# Altium schematic sheet ATM90E32AS.SchDoc: Three Phase Monitoring
size 419 x 296 mm; DocumentNumber: 3; SheetNumber: 3; SheetTotal: 4
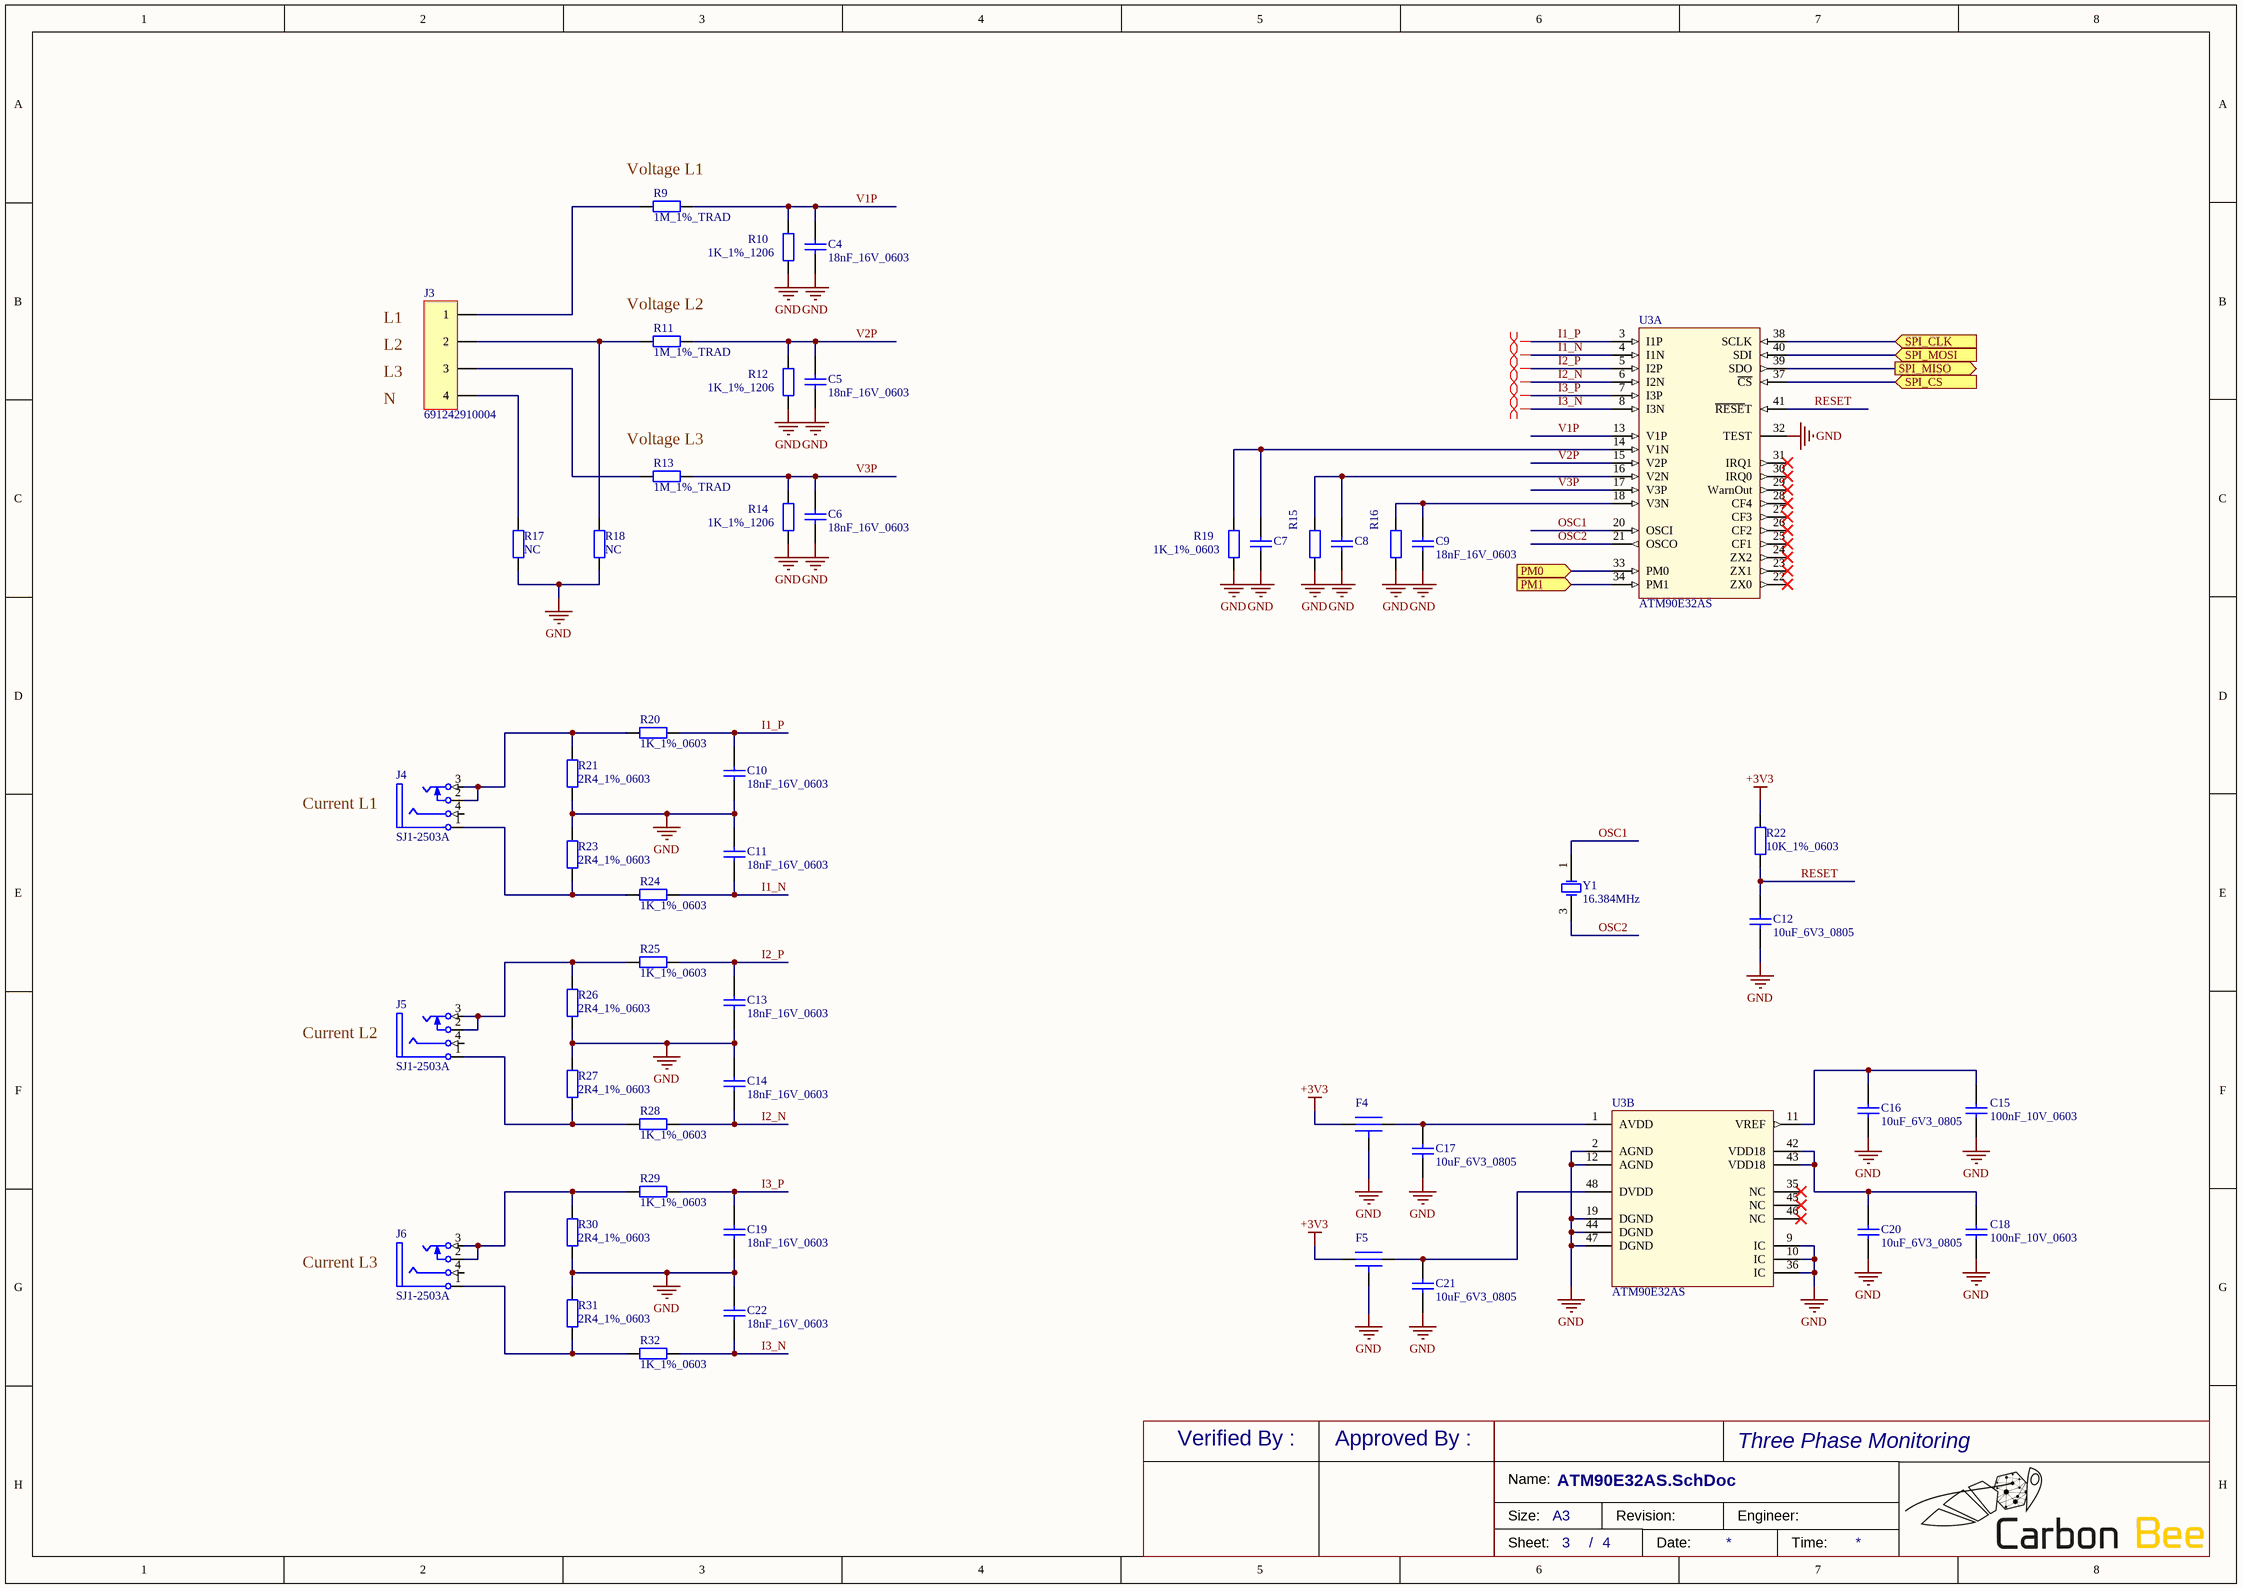
[diagram p0: ATM90E32AS.SchDoc]

## Parts
C4  18nF_16V_0603  [C0603]
C5  18nF_16V_0603  [C0603]
C6  18nF_16V_0603  [C0603]
C7  18nF_16V_0603  [C0603]  (value not drawn)
C8  18nF_16V_0603  [C0603]  (value not drawn)
C9  18nF_16V_0603  [C0603]
C10  18nF_16V_0603  [C0603]
C11  18nF_16V_0603  [C0603]
C12  10uF_6V3_0805  [C0805]
C13  18nF_16V_0603  [C0603]
C14  18nF_16V_0603  [C0603]
C15  100nF_10V_0603  [C0603]
C16  10uF_6V3_0805  [C0805]
C17  10uF_6V3_0805  [C0805]
C18  100nF_10V_0603  [C0603]
C19  18nF_16V_0603  [C0603]
C20  10uF_6V3_0805  [C0805]
C21  10uF_6V3_0805  [C0805]
C22  18nF_16V_0603  [C0603]
F4  EMI  [EMIFIL_0603]  (value not drawn)
F5  EMI  [EMIFIL_0603]  (value not drawn)
J3  691242910004  [691242910004]
J4  SJ1-2503A  [SJ1-2503A]
J5  SJ1-2503A  [SJ1-2503A]
J6  SJ1-2503A  [SJ1-2503A]
R9  1M_1%_TRAD  [AXIAL-0.3]
R10  1K_1%_1206  [R1206]
R11  1M_1%_TRAD  [AXIAL-0.3]
R12  1K_1%_1206  [R1206]
R13  1M_1%_TRAD  [AXIAL-0.3]
R14  1K_1%_1206  [R1206]
R15  1K_1%_0603  [R0603]  (value not drawn)
R16  1K_1%_0603  [R0603]  (value not drawn)
R17  NC  [AXIAL-0.4]
R18  NC  [AXIAL-0.4]
R19  1K_1%_0603  [R0603]
R20  1K_1%_0603  [R0603]
R21  2R4_1%_0603  [R0603]
R22  10K_1%_0603  [R0603]
R23  2R4_1%_0603  [R0603]
R24  1K_1%_0603  [R0603]
R25  1K_1%_0603  [R0603]
R26  2R4_1%_0603  [R0603]
R27  2R4_1%_0603  [R0603]
R28  1K_1%_0603  [R0603]
R29  1K_1%_0603  [R0603]
R30  2R4_1%_0603  [R0603]
R31  2R4_1%_0603  [R0603]
R32  1K_1%_0603  [R0603]
U3  ATM90E32AS  [TQFP48]  (parts A,B of 2)
Y1  16.384MHz  [OSC_3.2X2.5]

## Ports
PM0 (in), PM1 (in), SPI_CLK (in), SPI_CS (in), SPI_MISO (out), SPI_MOSI (in)

## Nets
+3V3: F4.2 F5.2 R22.2
GND: C4.1 C5.1 C6.1 C7.1 C8.1 C9.1 C10.1 C11.1 C12.1 C13.1 C14.1 C15.1 C16.1 C17.1 C18.1 C19.1 C20.1 C21.1 C22.1 F4.GND F5.GND R10.1 R12.1 R14.1 R15.1 R16.1 R17.2 R18.2 R19.1 R21.2 R23.2 R26.2 R27.2 R30.2 R31.2 U3.2(AGND) U3.9(IC) U3.10(IC) U3.12(AGND) U3.19(DGND) U3.32(TEST) U3.36(IC) U3.44(DGND) U3.47(DGND)
I1_N: C11.2 R24.1 U3.4(I1N)
I1_P: C10.2 R20.1 U3.3(I1P)
I2_N: C14.2 R28.1 U3.6(I2N)
I2_P: C13.2 R25.1 U3.5(I2P)
I3_N: C22.2 R32.1 U3.8(I3N)
I3_P: C19.2 R29.1 U3.7(I3P)
OSC1: U3.20(OSCI) Y1.1(OSC1)
OSC2: U3.21(OSCO) Y1.3(OSC2)
PM0: U3.33(PM0) ; port PM0
PM1: U3.34(PM1) ; port PM1
RESET: C12.2 R22.1 U3.41(~{RESE}T)
SPI_CLK: U3.38(SCLK) ; port SPI_CLK
SPI_CS: U3.37(~{CS}) ; port SPI_CS
SPI_MISO: U3.39(SDO) ; port SPI_MISO
SPI_MOSI: U3.40(SDI) ; port SPI_MOSI
V1P: C4.2 R9.1 R10.2 U3.13(V1P)
V2P: C5.2 R11.1 R12.2 U3.15(V2P)
V3P: C6.2 R13.1 R14.2 U3.17(V3P)
NetC7_2: C7.2 R19.2 U3.14(V1N)
NetC8_2: C8.2 R15.2 U3.16(V2N)
NetC9_2: C9.2 R16.2 U3.18(V3N)
NetC15_2: C15.2 C16.2 U3.11(VREF)
NetC17_2: C17.2 F4.1 U3.1(AVDD)
NetC18_2: C18.2 C20.2 U3.42(VDD18) U3.43(VDD18)
NetC21_2: C21.2 F5.1 U3.48(DVDD)
NetJ3_1: J3.1 R9.2
NetJ3_2: J3.2 R11.2 R18.1
NetJ3_3: J3.3 R13.2
NetJ3_4: J3.4 R17.1
NetJ4_1: J4.1(S) R23.1 R24.2
NetJ4_2: J4.2(TN) J4.3(T) R20.2 R21.1
NetJ5_1: J5.1(S) R27.1 R28.2
NetJ5_2: J5.2(TN) J5.3(T) R25.2 R26.1
NetJ6_1: J6.1(S) R31.1 R32.2
NetJ6_2: J6.2(TN) J6.3(T) R29.2 R30.1

Not connected (* = marked no-connect by the designer): J4 4(R); J5 4(R); J6 4(R); U3 22(ZX0)* 23(ZX1)* 24(ZX2)* 25(CF1)* 26(CF2)* 27(CF3)* 28(CF4)* 29(WarnOut)* 30(IRQ0)* 31(IRQ1)* 35(NC)* 45(NC)* 46(NC)*

## Layout directives
differential pair: I1_N, I1_P, I2_N, I2_P, I3_N, I3_P

## Notes on the sheet
- (near R9) Voltage L1
- L1
- (near R11) Voltage L2
- L2
- L3
- N
- (near R13) Voltage L3
- Current L1
- Current L2
- Current L3
- Verified By :
- Approved By :
- Size:
- Sheet:
- Name:
- A3
- /
- Revision:
- Date:
- Engineer:
- Time:

## Library data of the parts
C4-C11 C13 C14 C19 C22 = Cap: Capacitor; MPN: MC0603B183K160CT; MF: MULTICOMP; Supplier 1: Farnell; Supplier Part Number 1: 1759006; Supplier Pricing 1: 0,0444 €
C12 C16 C17 C20 C21 = Cap: Capacitor; MPN: MCTT21X106M6R3CT; MF: MULTICOMP; Supplier 1: Farnell; Supplier Part Number 1: 1759476; Supplier Pricing 1: 0,28 €
C15 C18 = Cap: Capacitor; MPN: MC0603B104K100CT; MF: MULTICOMP; Supplier 1: Farnell; Supplier Part Number 1: 2627427; Supplier Pricing 1: 0,0486 €
F4 F5 = EMIFIL_0603: FILTER CAP 0.1UF 2A 16V 0603; MPN: NFM18PC104R1C3D; MF: MURATA; Supplier 1: Farnell; Supplier Part Number 1: 1686508; Supplier Pricing 1: 0,083 €
J3 = 691242910004: Horizontal Cable Entry with Rising Cage Clamp, Serie 2429 - 7.5 mm; ComponentLink1 Description: Manufacturer; ComponentLink2 Description: Datasheet; MF: Wurth Elektronik; ComponentLink1 URL: http://www.we-online.com; ComponentLink2 URL: http://katalog.we-online.de/em/datasheet/6912429100xx.pdf; Supplier Pricing 1: 0,839 €; Supplier Part Number 1: 2493618; Supplier 1: Farnell; MPN: 691242910004
J4-J6 = Phonejack3 TN: Jack Socket, 1/4" [6.5mm], Thru-Hole, Vertical, 3-Conductor with Tip closed & Ring open; MF: CUI Inc.; Supplier Part Number 1: CP1-2503A-ND; MPN: SJ1-2503A; Supplier 1: Digi-Key; ComponentLink1Description: Manufacturer Link; ComponentLink1URL: http://www.cliffuk.co.uk/; Supplier Pricing 1: 0,60 €
R9 R11 R13 = RES: Resistor; MPN: MH25-1MJI; MF: TT ELECTRONICS / WELWYN; Supplier Pricing 1: 0,102 €; Supplier Part Number 1: 1100281; Supplier 1: Farnell
R10 R12 R14 = RES: Resistor; MPN: MC0125W120651K; MF: MULTICOMP; Supplier Pricing 1: 0,0119 €; Supplier Part Number 1: 9337008; Supplier 1: Farnell
R15 R16 R19 R20 R24 R25 R28 R29 R32 = RES: Resistor; MPN: CRCW06031K00FKEA; MF: VISHAY; Supplier Pricing 1: 0,0211€; Supplier Part Number 1: 1469740; Supplier 1: Farnell
R17 R18 = RES: Resistor; Supplier Pricing 1: *; MF: *; MPN: *; Supplier Part Number 1: *; Supplier 1: *
R21 R23 R26 R27 R30 R31 = RES: Resistor; MPN: WR06W2R40FTL; MF: WALSIN; Supplier Pricing 1: 0,0529 €; Supplier Part Number 1: 2668257; Supplier 1: Farnell
R22 = RES: Resistor; MPN: MCWR06X1002FTL; MF: MULTICOMP; Supplier Pricing 1: 0,0056€; Supplier Part Number 1: 2447230; Supplier 1: Farnell
U3 = ATM90E32AS: Enhanced Poly-Phase High-Performance Wide-Span Energy Metering IC; MPN: ATM90E32AS-AU-R; MF: MICROCHIP; Supplier 1: Farnell; Supplier Pricing 1: 2,17 €; Supplier Part Number 1: 2857740
Y1 = XTAL: Crystal Oscillator; MPN: MCSJK-7U-16.384-10-30-80-B-30; MF: MULTICOMP; Supplier 1: Farnell; Supplier Part Number 1: 2853939; Supplier Pricing 1: 0,159€